# Altium schematic sheet FreidoraAireCukiDigLeds.SchDoc: Freidora Aire Cuki
size A3; Author: Marianito; CompanyName: Marianito INC; DrawnBy: Marianito; Engineer: Marianito; PageSetup: Record=PageOptions|CenterHorizontal=True|CenterVertical=True|PrintScale=0.73|XCorrection=1.00|YCorrection=1.00|PrintKind=0|BorderSize=5000000|LeftOffset=0|BottomOffset=0|Orientation=2|PaperLength=1000|PaperWidth=1000|Scale=100|PaperSource=7|PrintQuality=-4|MediaType=1|DitherType=10|PrintScaleMode=1|PaperKind=A4; ProjectName: Freidora Aire Cuki
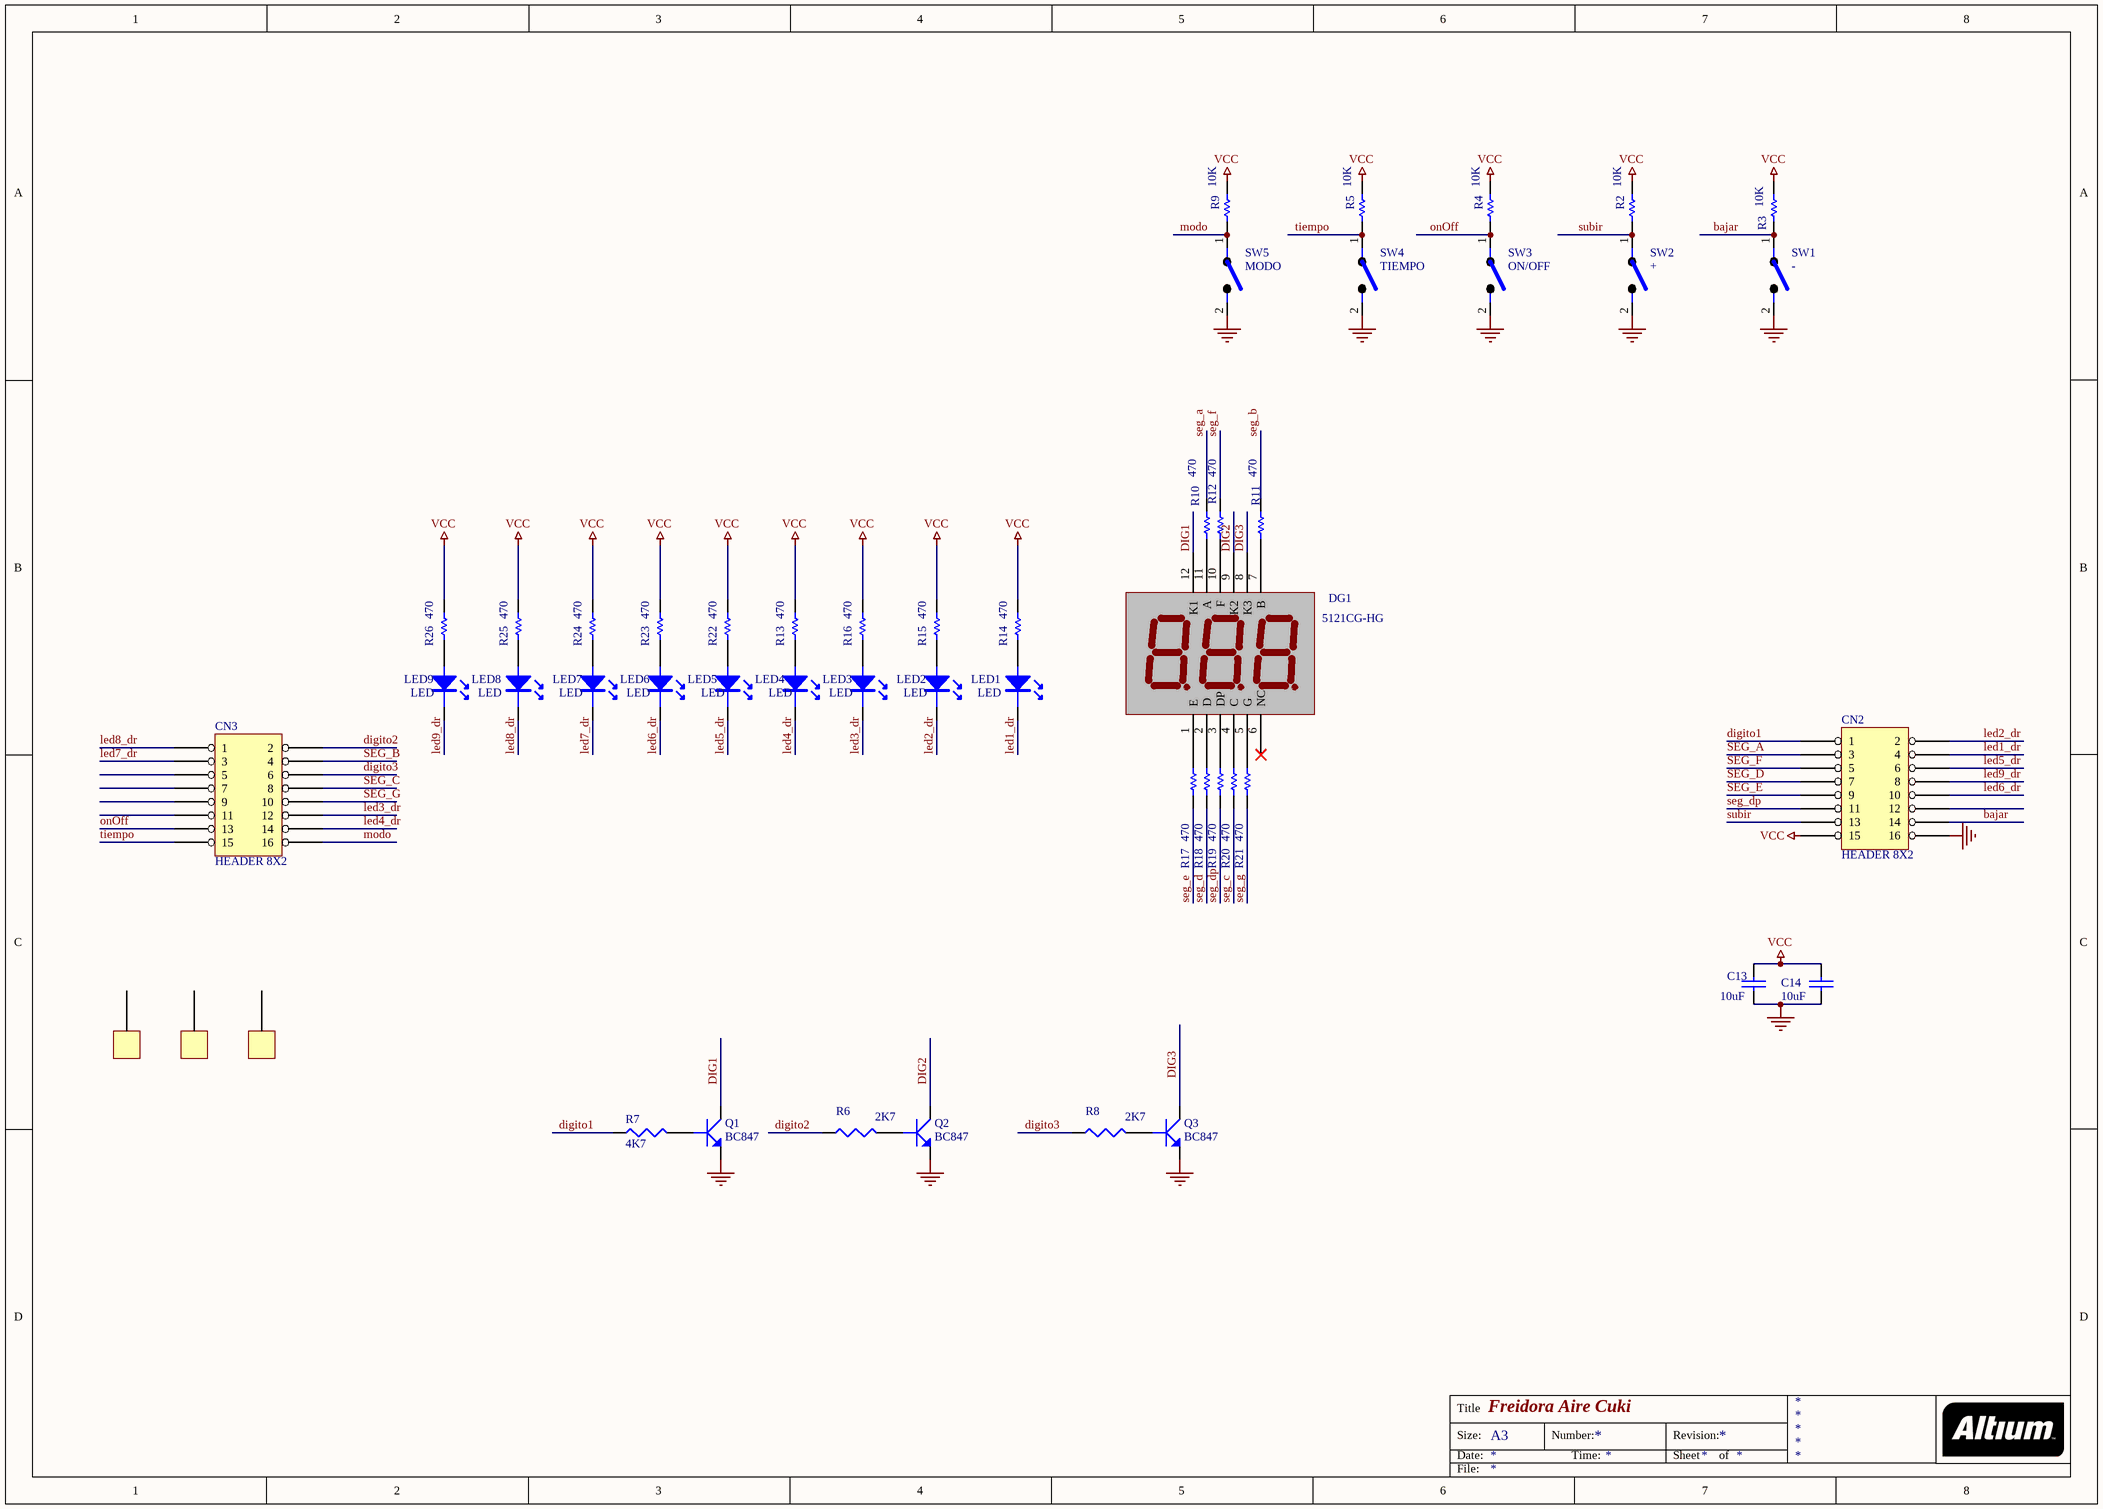
[diagram p0: FreidoraAireCukiDigLeds.SchDoc]

## Parts
C13  10uF  [C-0805_N]
C14  10uF  [C-0805_N]
CN2  HEADER 8X2  [SIP2X8]
CN3  HEADER 8X2  [SIP2X8]
DG1  5121CG-HG  [DIGIT_3_400]
LED1  LED  [LED3MM]
LED2  LED  [LED3MM]
LED3  LED  [LED3MM]
LED4  LED  [LED3MM]
LED5  LED  [LED3MM]
LED6  LED  [LED3MM]
LED7  LED  [LED3MM]
LED8  LED  [LED3MM]
LED9  LED  [LED3MM]
Q1  BC847  [SOT23_BOTTOM]
Q2  BC847  [SOT23_BOTTOM]
Q3  BC847  [SOT23_BOTTOM]
R2  10K  [0805BOTTOM]
R3  10K  [0805BOTTOM]
R4  10K  [0805BOTTOM]
R5  10K  [0805BOTTOM]
R6  2K7  [R-0805_N_WAVE]
R7  4K7  [R-0805_N_WAVE]
R8  2K7  [R-0805_N_WAVE]
R9  10K  [0805BOTTOM]
R10  470  [0805BOTTOM]
R11  470  [0805BOTTOM]
R12  470  [0805BOTTOM]
R13  470  [0805BOTTOM]
R14  470  [0805BOTTOM]
R15  470  [0805BOTTOM]
R16  470  [0805BOTTOM]
R17  470  [0805BOTTOM]
R18  470  [0805BOTTOM]
R19  470  [0805BOTTOM]
R20  470  [0805BOTTOM]
R21  470  [0805BOTTOM]
R22  470  [0805BOTTOM]
R23  470  [0805BOTTOM]
R24  470  [0805BOTTOM]
R25  470  [0805BOTTOM]
R26  470  [0805BOTTOM]
SW1  -  [ZIPPY-TS]
SW2  +  [ZIPPY-TS]
SW3  ON/OFF  [ZIPPY-TS]
SW4  TIEMPO  [ZIPPY-TS]
SW5  MODO  [ZIPPY-TS]
TORR1  (no value)  [TORRETA]
TORR2  (no value)  [TORRETA]
TORR3  (no value)  [TORRETA]

## Nets
GND: C13.1 C14.1 CN2.16 Q1.2(E) Q2.2(E) Q3.2(E) SW1.2 SW2.2 SW3.2 SW4.2 SW5.2
VCC: C13.2 C14.2 CN2.15 R2.2 R3.2 R4.2 R5.2 R9.2 R13.2 R14.2 R15.2 R16.2 R22.2 R23.2 R24.2 R25.2 R26.2
bajar: CN2.14 R3.1 SW1.1
DIG1: DG1.12(K1) Q1.3(C)
DIG2: DG1.9(K2) Q2.3(C)
DIG3: DG1.8(K3) Q3.3(C)
digito1: CN2.1 R7.1
digito2: CN3.2 R6.1
digito3: CN3.6 R8.1
led1_dr: CN2.4 LED1.2(K)
led2_dr: CN2.2 LED2.2(K)
led3_dr: CN3.12 LED3.2(K)
led4_dr: CN3.14 LED4.2(K)
led5_dr: CN2.6 LED5.2(K)
led6_dr: CN2.10 LED6.2(K)
led7_dr: CN3.3 LED7.2(K)
led8_dr: CN3.1 LED8.2(K)
led9_dr: CN2.8 LED9.2(K)
modo: CN3.16 R9.1 SW5.1
onOff: CN3.13 R4.1 SW3.1
seg_a: CN2.3 R10.2
seg_b: CN3.4 R11.2
seg_c: CN3.8 R20.1
seg_d: CN2.7 R18.1
seg_dp: CN2.11 R19.1
seg_e: CN2.9 R17.1
seg_f: CN2.5 R12.2
seg_g: CN3.10 R21.1
subir: CN2.13 R2.1 SW2.1
tiempo: CN3.15 R5.1 SW4.1
NetDG1_1: DG1.1(E) R17.2
NetDG1_2: DG1.2(D) R18.2
NetDG1_3: DG1.3(DP) R19.2
NetDG1_4: DG1.4(C) R20.2
NetDG1_5: DG1.5(G) R21.2
NetDG1_7: DG1.7(B) R11.1
NetDG1_10: DG1.10(F) R12.1
NetDG1_11: DG1.11(A) R10.1
NetLED1_1: LED1.1(A) R14.1
NetLED2_1: LED2.1(A) R15.1
NetLED3_1: LED3.1(A) R16.1
NetLED4_1: LED4.1(A) R13.1
NetLED5_1: LED5.1(A) R22.1
NetLED6_1: LED6.1(A) R23.1
NetLED7_1: LED7.1(A) R24.1
NetLED8_1: LED8.1(A) R25.1
NetLED9_1: LED9.1(A) R26.1
NetQ1_1: Q1.1(B) R7.2
NetQ2_1: Q2.1(B) R6.2
NetQ3_1: Q3.1(B) R8.2

Not connected (* = marked no-connect by the designer): CN2 12; CN3 5 7 9 11; DG1 6(NC)*; TORR1 0; TORR2 0; TORR3 0

## Notes on the sheet
- Title
- Size:
- Date:
- A3
- Number:
- Time:
- Revision:
- Sheet
- of
- File:

## Library data of the parts
C13 C14 = CAP: Non polarized capacitor; Value: 100nF; Price: 0,022
CN2 CN3 = HEADER 8X2: HEADER DE 2 X8
DG1 = DIGITO x 3 400: Dígito 0.52' cátodo común verde
LED1-LED9 = LED: Text Field1: 0,04
Q1-Q3 = BC847: NPN transistor bipolar
R2-R5 R9-R26 = RES1: Resistor; Value: 1K; Published: 8-Jun-2000; LatestRevisionDate: 17-Jul-2002; LatestRevisionNote: Re-released for DXP Platform.; PackageReference: AXIAL-0.3; Publisher: Altium Limited; PackageDescription: Axial Device, Thru-Hole; 2 Leads; 0.3 in Pin Spacing
R6-R8 = RES: Resistor; Text Field1: 0,012
SW1-SW5 = TECLA
TORR1-TORR3 = TORRETA